# Altium project tesis.PrjPcb (part 3 of 3)

## Sheet tesis_page5_adc_channels.SchDoc: ADC Channels
size A4; Date: 01/04/2021; SheetNumber: 5; SheetTotal: 5
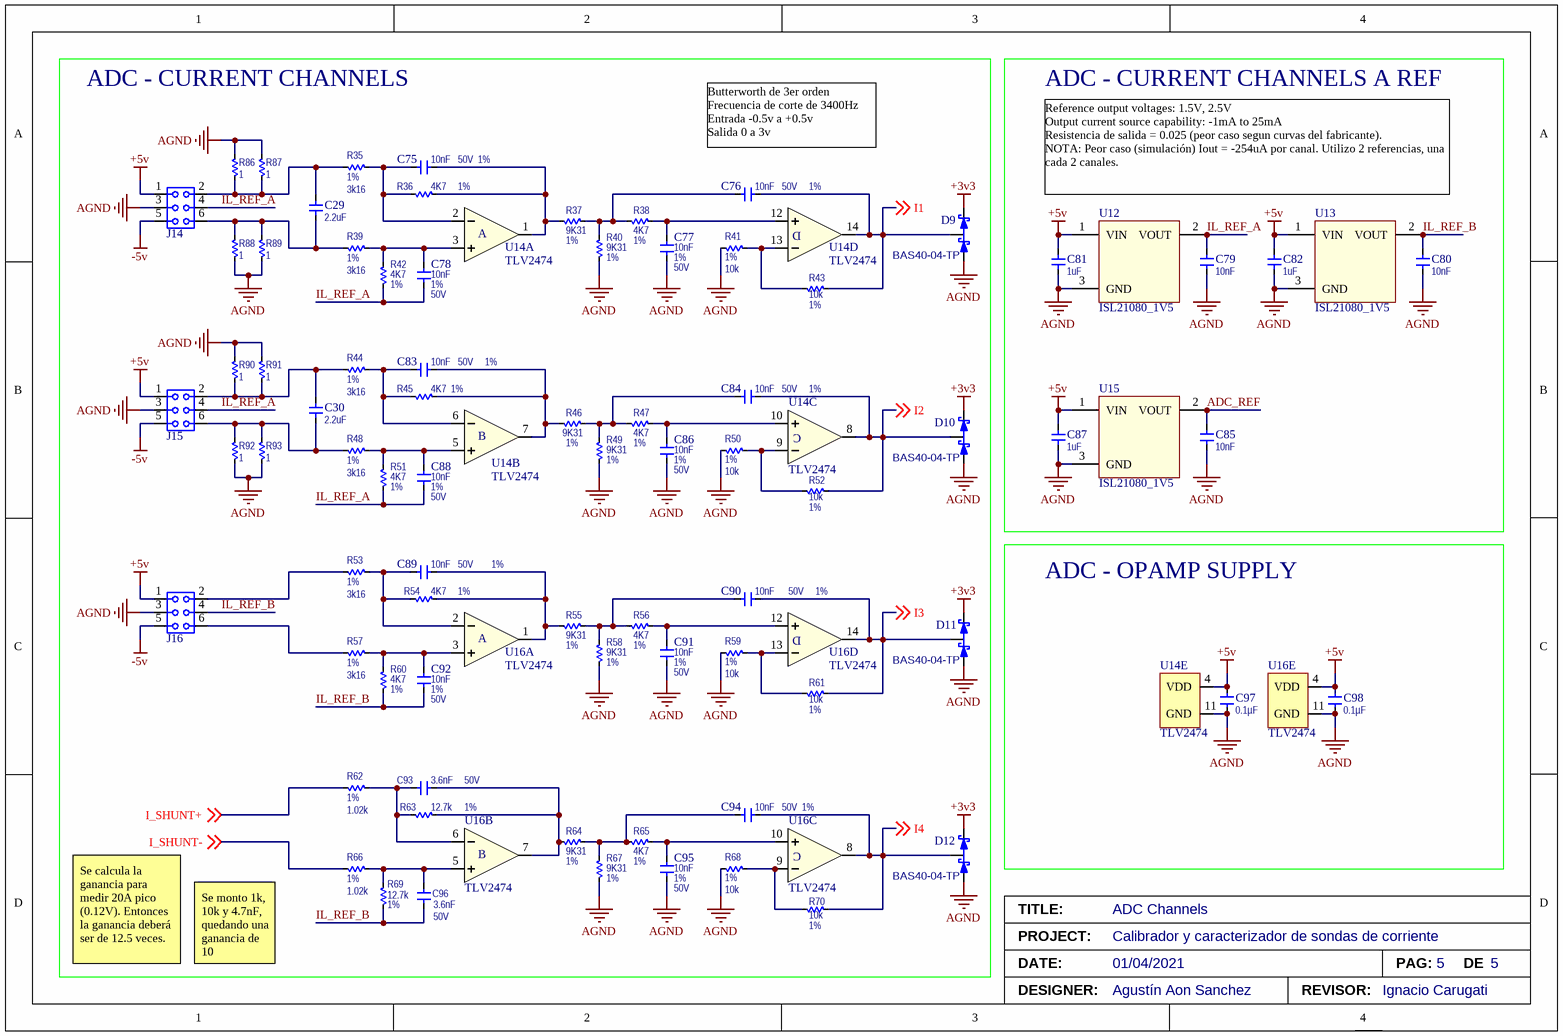
[diagram p4: tesis_page5_adc_channels.SchDoc]

### Parts
C29  value 2.2uF  [CAPC3216X135N_B]  (hidden comment: CAP_CC1206KKX7R7BB225_YAGEO)
C30  value 2.2uF  [CAPC3216X135N_B]  (hidden comment: CAP_CC1206KKX7R7BB225_YAGEO)
C75  value 10nF  Tolerance: 1%  Voltage Rating: 50V  [CAPC2013X110N]  (hidden comment: CAP_GRM2195C1H103FA01D_MURATA)
C76  value 10nF  Tolerance: 1%  Voltage Rating: 50V  [CAPC2013X110N]  (hidden comment: CAP_GRM2195C1H103FA01D_MURATA)
C77  value 10nF  Tolerance: 1%  Voltage Rating: 50V  [CAPC2013X110N]  (hidden comment: CAP_GRM2195C1H103FA01D_MURATA)
C78  value 10nF  Tolerance: 1%  Voltage Rating: 50V  [CAPC2013X110N]  (hidden comment: CAP_GRM2195C1H103FA01D_MURATA)
C79  value 10nF  [CAPC2013X110N]  (hidden comment: CAP_GRM2195C1H103FA01D_MURATA)
C80  value 10nF  [CAPC2013X110N]  (hidden comment: CAP_GRM2195C1H103FA01D_MURATA)
C81  value 1uF  [CAPC2013X110N]  (hidden comment: CAP_CC0805KKX7R7BB105_YAGEO)
C82  value 1uF  [CAPC2013X110N]  (hidden comment: CAP_CC0805KKX7R7BB105_YAGEO)
C83  value 10nF  Tolerance: 1%  Voltage Rating: 50V  [CAPC2013X110N]  (hidden comment: CAP_GRM2195C1H103FA01D_MURATA)
C84  value 10nF  Tolerance: 1%  Voltage Rating: 50V  [CAPC2013X110N]  (hidden comment: CAP_GRM2195C1H103FA01D_MURATA)
C85  value 10nF  [CAPC2013X110N]  (hidden comment: CAP_GRM2195C1H103FA01D_MURATA)
C86  value 10nF  Tolerance: 1%  Voltage Rating: 50V  [CAPC2013X110N]  (hidden comment: CAP_GRM2195C1H103FA01D_MURATA)
C87  value 1uF  [CAPC2013X110N]  (hidden comment: CAP_CC0805KKX7R7BB105_YAGEO)
C88  value 10nF  Tolerance: 1%  Voltage Rating: 50V  [CAPC2013X110N]  (hidden comment: CAP_GRM2195C1H103FA01D_MURATA)
C89  value 10nF  Tolerance: 1%  Voltage Rating: 50V  [CAPC2013X110N]  (hidden comment: CAP_GRM2195C1H103FA01D_MURATA)
C90  value 10nF  Tolerance: 1%  Voltage Rating: 50V  [CAPC2013X110N]  (hidden comment: CAP_GRM2195C1H103FA01D_MURATA)
C91  value 10nF  Tolerance: 1%  Voltage Rating: 50V  [CAPC2013X110N]  (hidden comment: CAP_GRM2195C1H103FA01D_MURATA)
C92  value 10nF  Tolerance: 1%  Voltage Rating: 50V  [CAPC2013X110N]  (hidden comment: CAP_GRM2195C1H103FA01D_MURATA)
C93  value 3.6nF  Voltage Rating: 50V  [CAPC2013X110N]  (hidden comment: CAP_GRM2165C1H362JA01D)
C94  value 10nF  Tolerance: 1%  Voltage Rating: 50V  [CAPC2013X110N]  (hidden comment: CAP_GRM2195C1H103FA01D_MURATA)
C95  value 10nF  Tolerance: 1%  Voltage Rating: 50V  [CAPC2013X110N]  (hidden comment: CAP_GRM2195C1H103FA01D_MURATA)
C96  value 3.6nF  Voltage Rating: 50V  [CAPC2013X110N]  (hidden comment: CAP_GRM2165C1H362JA01D)
C97  value 0.1µF  [CAPC2013X110N]  (hidden comment: CAP_CC0805KRX7R8BB104_YAGEO)
C98  value 0.1µF  [CAPC2013X110N]  (hidden comment: CAP_CC0805KRX7R8BB104_YAGEO)
D9  BAS40-04-TP  [SOT23-3M]
D10  BAS40-04-TP  [SOT23-3M]
D11  BAS40-04-TP  [SOT23-3M]
D12  BAS40-04-TP  [SOT23-3M]
J14  CON_Header_2x3_90º  [HDR2X3-90º]  (value not drawn)
J15  CON_Header_2x3_90º  [HDR2X3-90º]  (value not drawn)
J16  CON_Header_2x3_90º  [HDR2X3-90º]  (value not drawn)
R35  value 3k16  Tolerance: 1%  [RESC2013X065BN]  (hidden comment: RES_RC0805FR-073K16L_YAGEO)
R36  value 4K7  Tolerance: 1%  [RESC2013X065BN]  (hidden comment: RES_RC0805FR-074K7L_YAGEO)
R37  value 9K31  Tolerance: 1%  [RESC2013X065BN]  (hidden comment: RES_RC0805FR-079K31L_YAGEO)
R38  value 4K7  Tolerance: 1%  [RESC2013X065BN]  (hidden comment: RES_RC0805FR-074K7L_YAGEO)
R39  value 3k16  Tolerance: 1%  [RESC2013X065BN]  (hidden comment: RES_RC0805FR-073K16L_YAGEO)
R40  value 9K31  Tolerance: 1%  [RESC2013X065BN]  (hidden comment: RES_RC0805FR-079K31L_YAGEO)
R41  value 10k  Tolerance: 1%  [RESC2013X065BN]  (hidden comment: RES_RC0805FR-0710KL_YAGEO)
R42  value 4K7  Tolerance: 1%  [RESC2013X065BN]  (hidden comment: RES_RC0805FR-074K7L_YAGEO)
R43  value 10k  Tolerance: 1%  [RESC2013X065BN]  (hidden comment: RES_RC0805FR-0710KL_YAGEO)
R44  value 3k16  Tolerance: 1%  [RESC2013X065BN]  (hidden comment: RES_RC0805FR-073K16L_YAGEO)
R45  value 4K7  Tolerance: 1%  [RESC2013X065BN]  (hidden comment: RES_RC0805FR-074K7L_YAGEO)
R46  value 9K31  Tolerance: 1%  [RESC2013X065BN]  (hidden comment: RES_RC0805FR-079K31L_YAGEO)
R47  value 4K7  Tolerance: 1%  [RESC2013X065BN]  (hidden comment: RES_RC0805FR-074K7L_YAGEO)
R48  value 3k16  Tolerance: 1%  [RESC2013X065BN]  (hidden comment: RES_RC0805FR-073K16L_YAGEO)
R49  value 9K31  Tolerance: 1%  [RESC2013X065BN]  (hidden comment: RES_RC0805FR-079K31L_YAGEO)
R50  value 10k  Tolerance: 1%  [RESC2013X065BN]  (hidden comment: RES_RC0805FR-0710KL_YAGEO)
R51  value 4K7  Tolerance: 1%  [RESC2013X065BN]  (hidden comment: RES_RC0805FR-074K7L_YAGEO)
R52  value 10k  Tolerance: 1%  [RESC2013X065BN]  (hidden comment: RES_RC0805FR-0710KL_YAGEO)
R53  value 3k16  Tolerance: 1%  [RESC2013X065BN]  (hidden comment: RES_RC0805FR-073K16L_YAGEO)
R54  value 4K7  Tolerance: 1%  [RESC2013X065BN]  (hidden comment: RES_RC0805FR-074K7L_YAGEO)
R55  value 9K31  Tolerance: 1%  [RESC2013X065BN]  (hidden comment: RES_RC0805FR-079K31L_YAGEO)
R56  value 4K7  Tolerance: 1%  [RESC2013X065BN]  (hidden comment: RES_RC0805FR-074K7L_YAGEO)
R57  value 3k16  Tolerance: 1%  [RESC2013X065BN]  (hidden comment: RES_RC0805FR-073K16L_YAGEO)
R58  value 9K31  Tolerance: 1%  [RESC2013X065BN]  (hidden comment: RES_RC0805FR-079K31L_YAGEO)
R59  value 10k  Tolerance: 1%  [RESC2013X065BN]  (hidden comment: RES_RC0805FR-0710KL_YAGEO)
R60  value 4K7  Tolerance: 1%  [RESC2013X065BN]  (hidden comment: RES_RC0805FR-074K7L_YAGEO)
R61  value 10k  Tolerance: 1%  [RESC2013X065BN]  (hidden comment: RES_RC0805FR-0710KL_YAGEO)
R62  value 1.02k  Tolerance: 1%  [RESC2013X065BN]  (hidden comment: RES_RC0805FR-071K02L)
R63  value 12.7k  Tolerance: 1%  [RESC2013X065BN]  (hidden comment: RES_RC0805FR-0712K7L)
R64  value 9K31  Tolerance: 1%  [RESC2013X065BN]  (hidden comment: RES_RC0805FR-079K31L_YAGEO)
R65  value 4K7  Tolerance: 1%  [RESC2013X065BN]  (hidden comment: RES_RC0805FR-074K7L_YAGEO)
R66  value 1.02k  Tolerance: 1%  [RESC2013X065BN]  (hidden comment: RES_RC0805FR-071K02L)
R67  value 9K31  Tolerance: 1%  [RESC2013X065BN]  (hidden comment: RES_RC0805FR-079K31L_YAGEO)
R68  value 10k  Tolerance: 1%  [RESC2013X065BN]  (hidden comment: RES_RC0805FR-0710KL_YAGEO)
R69  value 12.7k  Tolerance: 1%  [RESC2013X065BN]  (hidden comment: RES_RC0805FR-0712K7L)
R70  value 10k  Tolerance: 1%  [RESC2013X065BN]  (hidden comment: RES_RC0805FR-0710KL_YAGEO)
R86  value 1  [RESC3216N]  (hidden comment: RES_RC1206FR-071RL)
R87  value 1  [RESC3216N]  (hidden comment: RES_RC1206FR-071RL)
R88  value 1  [RESC3216N]  (hidden comment: RES_RC1206FR-071RL)
R89  value 1  [RESC3216N]  (hidden comment: RES_RC1206FR-071RL)
R90  value 1  [RESC3216N]  (hidden comment: RES_RC1206FR-071RL)
R91  value 1  [RESC3216N]  (hidden comment: RES_RC1206FR-071RL)
R92  value 1  [RESC3216N]  (hidden comment: RES_RC1206FR-071RL)
R93  value 1  [RESC3216N]  (hidden comment: RES_RC1206FR-071RL)
U12  ISL21080_1V5  [SOT23-3M]
U13  ISL21080_1V5  [SOT23-3M]
U14  value TLV2474  [SOIC127P600-14AN]  (hidden comment: IC_TLV2474_ANALOG)  (parts A,B,C,D,E of 5)
U15  ISL21080_1V5  [SOT23-3M]
U16  value TLV2474  [SOIC127P600-14AN]  (hidden comment: IC_TLV2474_ANALOG)  (parts A,B,C,D,E of 5)

### Blocks framed on the sheet
ADC - CURRENT CHANNELS: C29 C30 C75-C78 C83 C84 C86 C88-C96 D9-D12 J14-J16 R35-R70 R86-R93 U14 U16
ADC - CURRENT CHANNELS A REF: C79-C82 C85 C87 U12 U13 U15
ADC - OPAMP SUPPLY: C97 C98 U14 U16

### Nets
+3v3: D9.2 D10.2 D11.2 D12.2
+5v: C81.1(T1) C82.1(T1) C87.1(T1) C97.1(T1) C98.1(T1) J14.1 J15.1 J16.1 U12.1(VIN) U13.1(VIN) U14.4(VDD) U15.1(VIN) U16.4(VDD)
-5v: J14.5 J15.5 J16.5
AGND: C77.1(T1) C79.2(T2) C80.2(T2) C81.2(T2) C82.2(T2) C85.2(T2) C86.1(T1) C87.2(T2) C91.1(T1) C95.1(T1) C97.2(T2) C98.2(T2) D9.1 D10.1 D11.1 D12.1 J14.3 J15.3 J16.3 R40.1(T1) R41.1(T1) R49.1(T1) R50.1(T1) R58.1(T1) R59.1(T1) R67.1(T1) R68.1(T1) R86.2(T2) R87.2(T2) R88.1(T1) R89.1(T1) R90.2(T2) R91.2(T2) R92.1(T1) R93.1(T1) U12.3(GND) U13.3(GND) U14.11(GND) U15.3(GND) U16.11(GND)
ADC_REF: C85.1(T1) U15.2(VOUT)
I1: C76.2(T2) D9.3 R43.1(T1) U14.14(OUTD) ; off-sheet I1
I2: C84.2(T2) D10.3 R52.1(T1) U14.8(OUTC) ; off-sheet I2
I3: C90.2(T2) D11.3 R61.1(T1) U16.14(OUTD) ; off-sheet I3
I4: C94.2(T2) D12.3 R70.1(T1) U16.8(OUTC) ; off-sheet I4
I_SHUNT+: R62.2(T2) ; off-sheet I_SHUNT+
I_SHUNT-: R66.2(T2) ; off-sheet I_SHUNT-
IL_REF_A: C78.1(T1) C79.1(T1) C88.1(T1) J14.4 J15.4 R42.2(T2) R51.2(T2) U12.2(VOUT)
IL_REF_B: C80.1(T1) C92.1(T1) C96.1(T1) J16.4 R60.2(T2) R69.2(T2) U13.2(VOUT)
NetC29_1: C29.1(T1) J14.2 R35.2(T2) R86.1(T1) R87.1(T1)
NetC29_2: C29.2(T2) J14.6 R39.2(T2) R88.2(T2) R89.2(T2)
NetC30_1: C30.1(T1) J15.2 R44.2(T2) R90.1(T1) R91.1(T1)
NetC30_2: C30.2(T2) J15.6 R48.2(T2) R92.2(T2) R93.2(T2)
NetC75_1: C75.1(T1) R35.1(T1) R36.2(T2) U14.2(INA-)
NetC75_2: C75.2(T2) R36.1(T1) R37.2(T2) U14.1(OUTA)
NetC76_1: C76.1(T1) R37.1(T1) R38.2(T2) R40.2(T2)
NetC77_2: C77.2(T2) R38.1(T1) U14.12(IND+)
NetC78_2: C78.2(T2) R39.1(T1) R42.1(T1) U14.3(INA+)
NetC83_1: C83.1(T1) R44.1(T1) R45.2(T2) U14.6(INB-)
NetC83_2: C83.2(T2) R45.1(T1) R46.2(T2) U14.7(OUTB)
NetC84_1: C84.1(T1) R46.1(T1) R47.2(T2) R49.2(T2)
NetC86_2: C86.2(T2) R47.1(T1) U14.10(INC+)
NetC88_2: C88.2(T2) R48.1(T1) R51.1(T1) U14.5(INB+)
NetC89_1: C89.1(T1) R53.1(T1) R54.2(T2) U16.2(INA-)
NetC89_2: C89.2(T2) R54.1(T1) R55.2(T2) U16.1(OUTA)
NetC90_1: C90.1(T1) R55.1(T1) R56.2(T2) R58.2(T2)
NetC91_2: C91.2(T2) R56.1(T1) U16.12(IND+)
NetC92_2: C92.2(T2) R57.1(T1) R60.1(T1) U16.3(INA+)
NetC93_1: C93.1(T1) R62.1(T1) R63.2(T2) U16.6(INB-)
NetC93_2: C93.2(T2) R63.1(T1) R64.2(T2) U16.7(OUTB)
NetC94_1: C94.1(T1) R64.1(T1) R65.2(T2) R67.2(T2)
NetC95_2: C95.2(T2) R65.1(T1) U16.10(INC+)
NetC96_2: C96.2(T2) R66.1(T1) R69.1(T1) U16.5(INB+)
NetJ16_2: J16.2 R53.2(T2)
NetJ16_6: J16.6 R57.2(T2)
NetR41_2: R41.2(T2) R43.2(T2) U14.13(IND-)
NetR50_2: R50.2(T2) R52.2(T2) U14.9(INC-)
NetR59_2: R59.2(T2) R61.2(T2) U16.13(IND-)
NetR68_2: R68.2(T2) R70.2(T2) U16.9(INC-)

### Notes on the sheet
- Butterworth de 3er orden
  Frecuencia de corte de 3400Hz
  Entrada -0.5v a +0.5v
  Salida 0 a 3v
- Reference output voltages: 1.5V, 2.5V
  Output current source capability: -1mA to 25mA
  Resistencia de salida = 0.025 (peor caso segun curvas del fabricante).
  NOTA: Peor caso (simulación) Iout = -254uA por canal. Utilizo 2 referencias, una cada 2 canales.
- Se calcula la ganancia para medir 20A pico (0.12V). Entonces la ganancia deberá ser de 12.5 veces.
- Se monto 1k, 10k y 4.7nF, quedando una ganancia de 10
- TITLE:
- PROJECT:
- DATE:
- DESIGNER:
- Calibrador y caracterizador de sondas de corriente
- 01/04/2021
- Agustín Aon Sanchez
- REVISOR:
- Ignacio Carugati
- PAG:
- DE
- (in symbol IC_TLV2474_ANALOG, part A) A
- (in symbol IC_TLV2474_ANALOG, part B) B
- (in symbol IC_TLV2474_ANALOG, part C) C
- (in symbol IC_TLV2474_ANALOG, part D) D

### Library data of the parts
C29 C30 = CAP_CC1206KKX7R7BB225_YAGEO: CAP CER 2.2UF 16V X7R 1206; Manufacturer: YAGEO; Tolerance: 10%; Supplier: *; Supplier Part No: *; Power Rating: *; BOM Populate: *; Voltage Rating: 16V; Digikey Part Number: 311-1957-1-ND; Mouser Part Number: 603-CC126KKX7R7BB225; Manufacturer Part Number: CC1206KKX7R7BB225
C75-C78 C83 C84 C86 C88-C92 C94 C95 = CAP_GRM2195C1H103FA01D_MURATA: CAP CER 10000PF 50V NP0 0805; Manufacturer: Murata Electronics North America; Supplier: *; Power Rating: *; BOM Populate: *; Digikey Part Number: 490-8295-1-ND; Mouser Part Number: 81-GRM2195C1H103FA1D; Manufacturer Part Number: GRM2195C1H103FA01D
C79 C80 C85 = CAP_GRM2195C1H103FA01D_MURATA: CAP CER 10000PF 50V NP0 0805; Manufacturer: Murata Electronics North America; Tolerance: 1%; Digikey Part Number: 490-8295-1-ND; Supplier: *; Power Rating: *; BOM Populate: *; Mouser Part Number: 81-GRM2195C1H103FA1D; Manufacturer Part Number: GRM2195C1H103FA01D; Voltage Rating: 50V
C81 C82 C87 = CAP_CC0805KKX7R7BB105_YAGEO: CAP CER 1UF 16V X7R 0805; Manufacturer: YAGEO; Tolerance: 10%; Supplier: *; Supplier Part No: *; Power Rating: *; BOM Populate: *; Voltage Rating: 16V; Digikey Part Number: 311-1365-1-ND; Mouser Part Number: 603-CC805KKX7R7BB105; Manufacturer Part Number: CC0805KKX7R7BB105
C93 C96 = CAP_GRM2165C1H362JA01D: CAP CER 3600PF 50V C0G/NP0 0805; Manufacturer: Murata; Tolerance: 5%; Dielectric: C0G; Manufacturer Part Number: GRM2165C1H362JA01D; Supplier 1: Digi-Key; Supplier Part Number 1: 490-3318-1-ND; Category: Ceramic Capacitors; Mount: Surface Mount; Case/Package: 0805; Case Code (Metric): 2012; Case Code (Imperial): 0805; Min Operating Temperature: -55°C; Max Operating Temperature: 125°C; Package Quantity: 1; Packaging: Tape and Reel; Voltage Rating (DC): 50V; Termination: SMD/SMT; Series: GRM; Construction: Flat; Length: 2mm; Width: 0.049inch; Height: 0.6mm; Thickness: 0.028inch; Depth: 1.25mm; Radiation Hardening: No; Lead Free: Lead Free; RoHS Compliant: Yes; ComponentLink1URL: https://datasheet.ciiva.com/29542/grm2165c1h362ja01-01-29542674.pdf?src-supplier=Digi-Key; ComponentLink1Description: https://datasheet.ciiva.com/29542/grm2165c1h362ja01-01-29542674.pdf?src-supplier=Digi-Key; ComponentLink2URL: https://datasheet.ciiva.com/5423/product-5423670.pdf?src-supplier=Mouser; ComponentLink2Description: https://datasheet.ciiva.com/5423/product-5423670.pdf?src-supplier=Mouser; ComponentLink3URL: https://datasheet.ciiva.com/169/partnumbering-e-01-169119.pdf?src-supplier=Digi-Key; ComponentLink3Description: https://datasheet.ciiva.com/169/partnumbering-e-01-169119.pdf?src-supplier=Digi-Key
C97 C98 = CAP_CC0805KRX7R8BB104_YAGEO: CAP CER 0.1UF 25V 10% X7R 0805; Manufacturer: Yageo; Supplier: *; Tolerance: 10%; Power Rating: *; Voltage Rating: 25V; BOM Populate: *; Digikey Part Number: 311-1141-1-ND; Mouser Part Number: 603-CC805KRX7R8BB104; Manufacturer Part Number: CC0805KRX7R8BB104
D9-D12 = DIO_BAS40-04-TP: DIODE ARRAY SCHOTTKY 40V SOT23; Manufacturer: MCC; Max Surge Current: 600mA; Recovery Time: 5ns; Forward Current: 200mA; Forward Voltage: 1V; Max Reverse Leakage Current: 200nA; Power Dissipation: 200mW; Capacitance: 5pF; Element Configuration: Single; Supplier 1: Digi-Key; Manufacturer Part Number: BAS40-04-TP; RoHS: Yes; Category: Rectifier Diodes; Stock 1: 1037806; Pricing 1: 1=0,24000, 10=0,19400, 100=0,07920, 500=0,06606, 1000=0,04590 (USD); Mount: Surface Mount; Case/Package: SOT-23; Number of Pins: 3; Min Operating Temperature: -55°C; Max Operating Temperature: 125°C; Package Quantity: 3000; Packaging: Tape and Reel; Average Rectified Current: 200mA; Reverse Recovery Time: 5ns; Max Forward Surge Current (Ifsm): 600mA; Max Reverse Current: 200nA; Max Repetitive Reverse Voltage (Vrrm): 40V; Peak Non-Repetitive Surge Current: 600mA; Max Reverse Voltage (DC): 40V; Length: 3.04mm; Width: 1.4mm; Height: 1.02mm; Radiation Hardening: No; REACH SVHC: Unknown; Lead Free: Lead Free; ComponentLink1URL: https://datasheet.ciiva.com/4716/bas40-bas70sot-23-28891-4716000.pdf?src-supplier=Mouser; ComponentLink1Description: https://datasheet.ciiva.com/4716/bas40-bas70sot-23-28891-4716000.pdf?src-supplier=Mouser; ComponentLink2URL: https://datasheet.ciiva.com/23684/1684803-23684306.pdf?src-supplier=Newark; ComponentLink2Description: https://datasheet.ciiva.com/23684/1684803-23684306.pdf?src-supplier=Newark; ComponentLink3URL: https://datasheet.ciiva.com/906/bas40-bas70sot-23-906320.pdf?src-supplier=Digi-Key; ComponentLink3Description: https://datasheet.ciiva.com/906/bas40-bas70sot-23-906320.pdf?src-supplier=Digi-Key; ComponentLink4URL: https://datasheet.ciiva.com/15200/getdatasheetpartid-226544-15200426.pdf?src-supplier=Verical; ComponentLink4Description: https://datasheet.ciiva.com/15200/getdatasheetpartid-226544-15200426.pdf?src-supplier=Verical; ComponentLink5URL: https://datasheet.ciiva.com/7624/1684803-7624699.pdf?src-supplier=Element14; ComponentLink5Description: https://datasheet.ciiva.com/7624/1684803-7624699.pdf?src-supplier=Element14; ComponentLink6URL: https://datasheet.ciiva.com/906/bas40-bas70sot-23-906318.pdf?src-supplier=Digi-Key; ComponentLink6Description: https://datasheet.ciiva.com/906/bas40-bas70sot-23-906318.pdf?src-supplier=Digi-Key; ComponentLink7URL: https://datasheet.ciiva.com/906/bas40-bas70sot-23-906319.pdf?src-supplier=Digi-Key; ComponentLink7Description: https://datasheet.ciiva.com/906/bas40-bas70sot-23-906319.pdf?src-supplier=Digi-Key; Supplier Part Number 1: BAS40-04TPMSCT-ND
R35 R39 R44 R48 R53 R57 = RES_RC0805FR-073K16L_YAGEO: RES SMD 3.16K OHM 1% 1/8W 0805; Manufacturer: Yageo; BOM Populate: *; Supplier Part No: *; Supplier: *; Digikey Part Number: 311-3.16KCRCT-ND; Power Rating: 1/8W; Manufacturer Part Number: RC0805FR-073K16L; Mouser Part Number: 603-RC0805FR-073K16L
R36 R38 R42 R45 R47 R51 R54 R56 R60 R65 = RES_RC0805FR-074K7L_YAGEO: RES SMD 4.7K OHM 1% 1/8W 0805; Manufacturer: Yageo; BOM Populate: *; Supplier Part No: *; Supplier: *; Digikey Part Number: 311-4.70KCRCT-ND; Power Rating: 1/8W; Manufacturer Part Number: RC0805FR-074K7L; Mouser Part Number: 603-RC0805FR-074K7L
R37 R40 R46 R49 R55 R58 R64 R67 = RES_RC0805FR-079K31L_YAGEO: RES SMD 9.31K OHM 1% 1/8W 0805; Manufacturer: Yageo; BOM Populate: *; Supplier Part No: *; Supplier: *; Digikey Part Number: 311-9.31KCRCT-ND; Power Rating: 1/8W; Manufacturer Part Number: RC0805FR-079K31L; Mouser Part Number: 603-RC0805FR-079K31L
R41 R43 R50 R52 R59 R61 R68 R70 = RES_RC0805FR-0710KL_YAGEO: RES SMD 10K OHM 1% 1/8W 0805; Manufacturer: Yageo; BOM Populate: *; Supplier Part No: *; Supplier: *; Digikey Part Number: 311-10.0KCRCT-ND; Power Rating: 1/8W; Manufacturer Part Number: RC0805FR-0710KL; Mouser Part Number: 603-RC0805FR-0710KL
R62 R66 = RES_RC0805FR-071K02L: RES SMD 1.02K OHM 1% 1/8W 0805; Manufacturer: Yageo; Power Rating: 125mW; Voltage Rating: 150V; Temperature Coefficient: 100ppm/°C; Manufacturer Part Number: RC0805FR-071K02L; Supplier 1: Digi-Key; Supplier Part Number 1: 311-1.02KCRCT-ND; Category: Chip SMD Resistors; Case/Package: 0805; Case Code (Imperial): 0805; Case Code (Metric): 2012; Size Code: 0805; Min Operating Temperature: -55°C; Max Operating Temperature: 155°C; Packaging: Tape and Reel; Termination: SMD/SMT; Resistor Type: Thick Film; Voltage Rating (DC): 150V; Features: Moisture Resistant; Series: RC; Max Power Dissipation: 125mW; Number of Terminations: 2; Construction: Rectangular; Length: 2mm; Width: 1.25mm; Height: 0.5mm; Depth: 1.25mm; Military Standard: Not; Lead Free: Lead Free; RoHS Compliant: Yes; ComponentLink1URL: https://datasheet.ciiva.com/12557/rc0805-257173-12557847.pdf?src-supplier=Mouser; ComponentLink1Description: https://datasheet.ciiva.com/12557/rc0805-257173-12557847.pdf?src-supplier=Mouser; ComponentLink2URL: https://datasheet.ciiva.com/16746/rc0805-16746216.pdf?src-supplier=Future+Electronics; ComponentLink2Description: https://datasheet.ciiva.com/16746/rc0805-16746216.pdf?src-supplier=Future+Electronics
R63 R69 = RES_RC0805FR-0712K7L: RES SMD 12.7K OHM 1% 1/8W 0805; Manufacturer: Yageo; Power Rating: 125mW; Voltage Rating: 150V; Temperature Coefficient: 100ppm/°C; Manufacturer Part Number: RC0805FR-0712K7L; Supplier 1: Digi-Key; Supplier Part Number 1: 311-12.7KCRCT-ND; Category: Chip SMD Resistors; Case/Package: 0805; Case Code (Imperial): 0805; Case Code (Metric): 2012; Size Code: 0805; Min Operating Temperature: -55°C; Max Operating Temperature: 155°C; Packaging: Tape and Reel; Package Quantity: 1; Termination: SMD/SMT; Resistor Type: Thick Film; Number of Terminations: 2; Max Power Dissipation: 125mW; Voltage Rating (DC): 150V; Features: Moisture Resistant; Series: RC; Construction: Rectangular; Length: 2mm; Width: 1.25mm; Height: 0.024inch; Depth: 1.25mm; Military Standard: Not; Lead Free: Lead Free; RoHS Compliant: Yes; ComponentLink1URL: https://datasheet.ciiva.com/12555/rc0805-257173-12555397.pdf?src-supplier=Mouser; ComponentLink1Description: https://datasheet.ciiva.com/12555/rc0805-257173-12555397.pdf?src-supplier=Mouser; ComponentLink2URL: https://datasheet.ciiva.com/2491/pyu-r-int-thick-7-2491627.pdf?src-supplier=Digi-Key; ComponentLink2Description: https://datasheet.ciiva.com/2491/pyu-r-int-thick-7-2491627.pdf?src-supplier=Digi-Key; ComponentLink3URL: https://datasheet.ciiva.com/2491/pyu-r-int-thick-7-2491628.pdf?src-supplier=Digi-Key; ComponentLink3Description: https://datasheet.ciiva.com/2491/pyu-r-int-thick-7-2491628.pdf?src-supplier=Digi-Key; ComponentLink4URL: https://datasheet.ciiva.com/2491/pyu-r-int-thick-7-2491629.pdf?src-supplier=Digi-Key; ComponentLink4Description: https://datasheet.ciiva.com/2491/pyu-r-int-thick-7-2491629.pdf?src-supplier=Digi-Key
R86-R93 = RES_RC1206FR-071RL: YAGEO - RC1206FR-071RL - RES, THICK FILM, 1R, 1%, 0.25W, 1206; Power Rating: 250mW; Voltage Rating (DC): 200V; Temperature Coefficient: 200ppm/°C; Tolerance: 1%; Manufacturer: Yageo; Manufacturer Part Number: RC1206FR-071RL; Supplier 1: Digi-Key; Supplier Part Number 1: 311-1.00FRCT-ND; Category: Chip SMD Resistors; Case/Package: 1206; Number of Pins: 2; Case Code (Metric): 3216; Case Code (Imperial): 1206; Size Code: 1206; Min Operating Temperature: -55°C; Max Operating Temperature: 155°C; Resistor Type: Thick Film; Voltage Rating: 200V; Packaging: Tape and Reel; Package Quantity: 5000; Number of Terminations: 2; Termination: SMD/SMT; Max Power Dissipation: 250mW; Features: Moisture Resistant; Series: RC; Resistance Tolerance: 1%; Technology: THICK FILM; Construction: Rectangular; Length: 3.1mm; Width: 0.063inch; Height: 0.026inch; Depth: 1.6mm; RoHS Compliant: Yes; REACH SVHC: No SVHC; Military Standard: Not; Lead Free: Lead Free; ComponentLink1URL: https://datasheet.ciiva.com/11808/0900766b80c6630a-11808247.pdf?src-supplier=RSComponents; ComponentLink1Description: https://datasheet.ciiva.com/11808/0900766b80c6630a-11808247.pdf?src-supplier=RSComponents; ComponentLink2URL: https://datasheet.ciiva.com/16905/pyu-rc1206-51-rohs-l-4-16905929.pdf?src-supplier=Future+Electronics; ComponentLink2Description: https://datasheet.ciiva.com/16905/pyu-rc1206-51-rohs-l-4-16905929.pdf?src-supplier=Future+Electronics; ComponentLink3URL: https://datasheet.ciiva.com/46445/444357-46445710.pdf?src-supplier=Element14; ComponentLink3Description: https://datasheet.ciiva.com/46445/444357-46445710.pdf?src-supplier=Element14
U12 U13 U15 = IC_ISL21080CIH315Z-TK_INTERSIL: IC VREF SERIES 1.5V SOT23-3; Digikey Part Number: ISL21080CIH315Z-TKCT-ND; Mouser Part Number: 968-ISL21080CIH315ZT; Manufacturer Part Number: ISL21080CIH315Z-TK
U14 U16 = IC_TLV2474_ANALOG: IC OPAMP GP 2.8MHZ RRO 14SOIC; Manufacturer: Texas Instrument; Manufacturer Part Number: TLV2474CDR; BOM_Populate: *; Digikey Part Number: 296-2442-1-ND; Mouser Part Number: 595-TLV2474CDR

## Nets that join several sheets
+1v8: tesis_page1_supply (C102.1 J3.1 U1.2 U1.4), tesis_page4_adc (C73.2 U11.26)
+3v3: tesis_page1_supply (C22.1 J5.1 R4.2 U5.4), tesis_page2_arm (28 pins), tesis_page3_power_stage (8 pins), tesis_page4_adc (16 pins), tesis_page5_adc_channels (D9.2 D10.2 D11.2 D12.2)
+5v: tesis_page1_supply (14 pins), tesis_page3_power_stage (C27.2 C28.2 U17.8), tesis_page4_adc (8 pins), tesis_page5_adc_channels (13 pins)
+12v: tesis_page1_supply (8 pins), tesis_page3_power_stage (10 pins)
+24v: tesis_page1_supply (6 pins), tesis_page3_power_stage (L4.1)
-5v: tesis_page1_supply (6 pins), tesis_page5_adc_channels (J14.5 J15.5 J16.5)
AGND: tesis_page1_supply (41 pins), tesis_page2_arm (46 pins), tesis_page3_power_stage (30 pins), tesis_page4_adc (39 pins), tesis_page5_adc_channels (40 pins)
ETH: tesis_page1_supply (J10.1), tesis_page3_power_stage (8 pins)
AD2: tesis_page2_arm (U7.13), tesis_page4_adc (J18.1)
AD3: tesis_page2_arm (U7.16), tesis_page4_adc (J20.1)
AD8: tesis_page2_arm (U7.11), tesis_page4_adc (J17.1)
AD9: tesis_page2_arm (U7.14), tesis_page4_adc (J19.1)
ADC_REF: tesis_page4_adc (10 pins), tesis_page5_adc_channels (C85.1 U15.2)
I1: tesis_page4_adc (J17.2), tesis_page5_adc_channels (C76.2 D9.3 R43.1 U14.14)
I2: tesis_page4_adc (J18.2), tesis_page5_adc_channels (C84.2 D10.3 R52.1 U14.8)
I3: tesis_page4_adc (J19.2), tesis_page5_adc_channels (C90.2 D11.3 R61.1 U16.14)
I4: tesis_page3_power_stage (U17.3), tesis_page4_adc (J20.2), tesis_page5_adc_channels (C94.2 D12.3 R70.1 U16.8)
I_SHUNT+: tesis_page3_power_stage (R71.2), tesis_page5_adc_channels (R62.2)
I_SHUNT-: tesis_page3_power_stage (R71.1), tesis_page5_adc_channels (R66.2)
PA0: tesis_page2_arm (U7.48), tesis_page3_power_stage (R82.2 U3.14)
PA1: tesis_page2_arm (U7.47), tesis_page3_power_stage (R95.1 U3.13)
PA2: tesis_page2_arm (U7.44), tesis_page3_power_stage (R27.2 U10.12)
PA9: tesis_page2_arm (U7.30), tesis_page3_power_stage (R7.1 R26.1 U17.7)
PA15: tesis_page2_arm (U7.20), tesis_page4_adc (R33.1)
PA24: tesis_page2_arm (U7.23), tesis_page4_adc (R79.1)
PA29: tesis_page2_arm (U7.41), tesis_page3_power_stage (R94.1 U10.13)
PA30: tesis_page2_arm (U7.42), tesis_page3_power_stage (R28.2 U10.14)
SPI_MISO: tesis_page2_arm (U7.27), tesis_page4_adc (R32.1)
SPI_SPCK: tesis_page2_arm (U7.21), tesis_page4_adc (R34.1)
TDO: tesis_page2_arm (ARM_JTAG.6 R11.1 U7.49), tesis_page3_power_stage (R81.2 U3.12)